# EAGLE design vizszintkapcs_v1_4 (EAGLE 7.1.0)

## Sheet 1 of 2
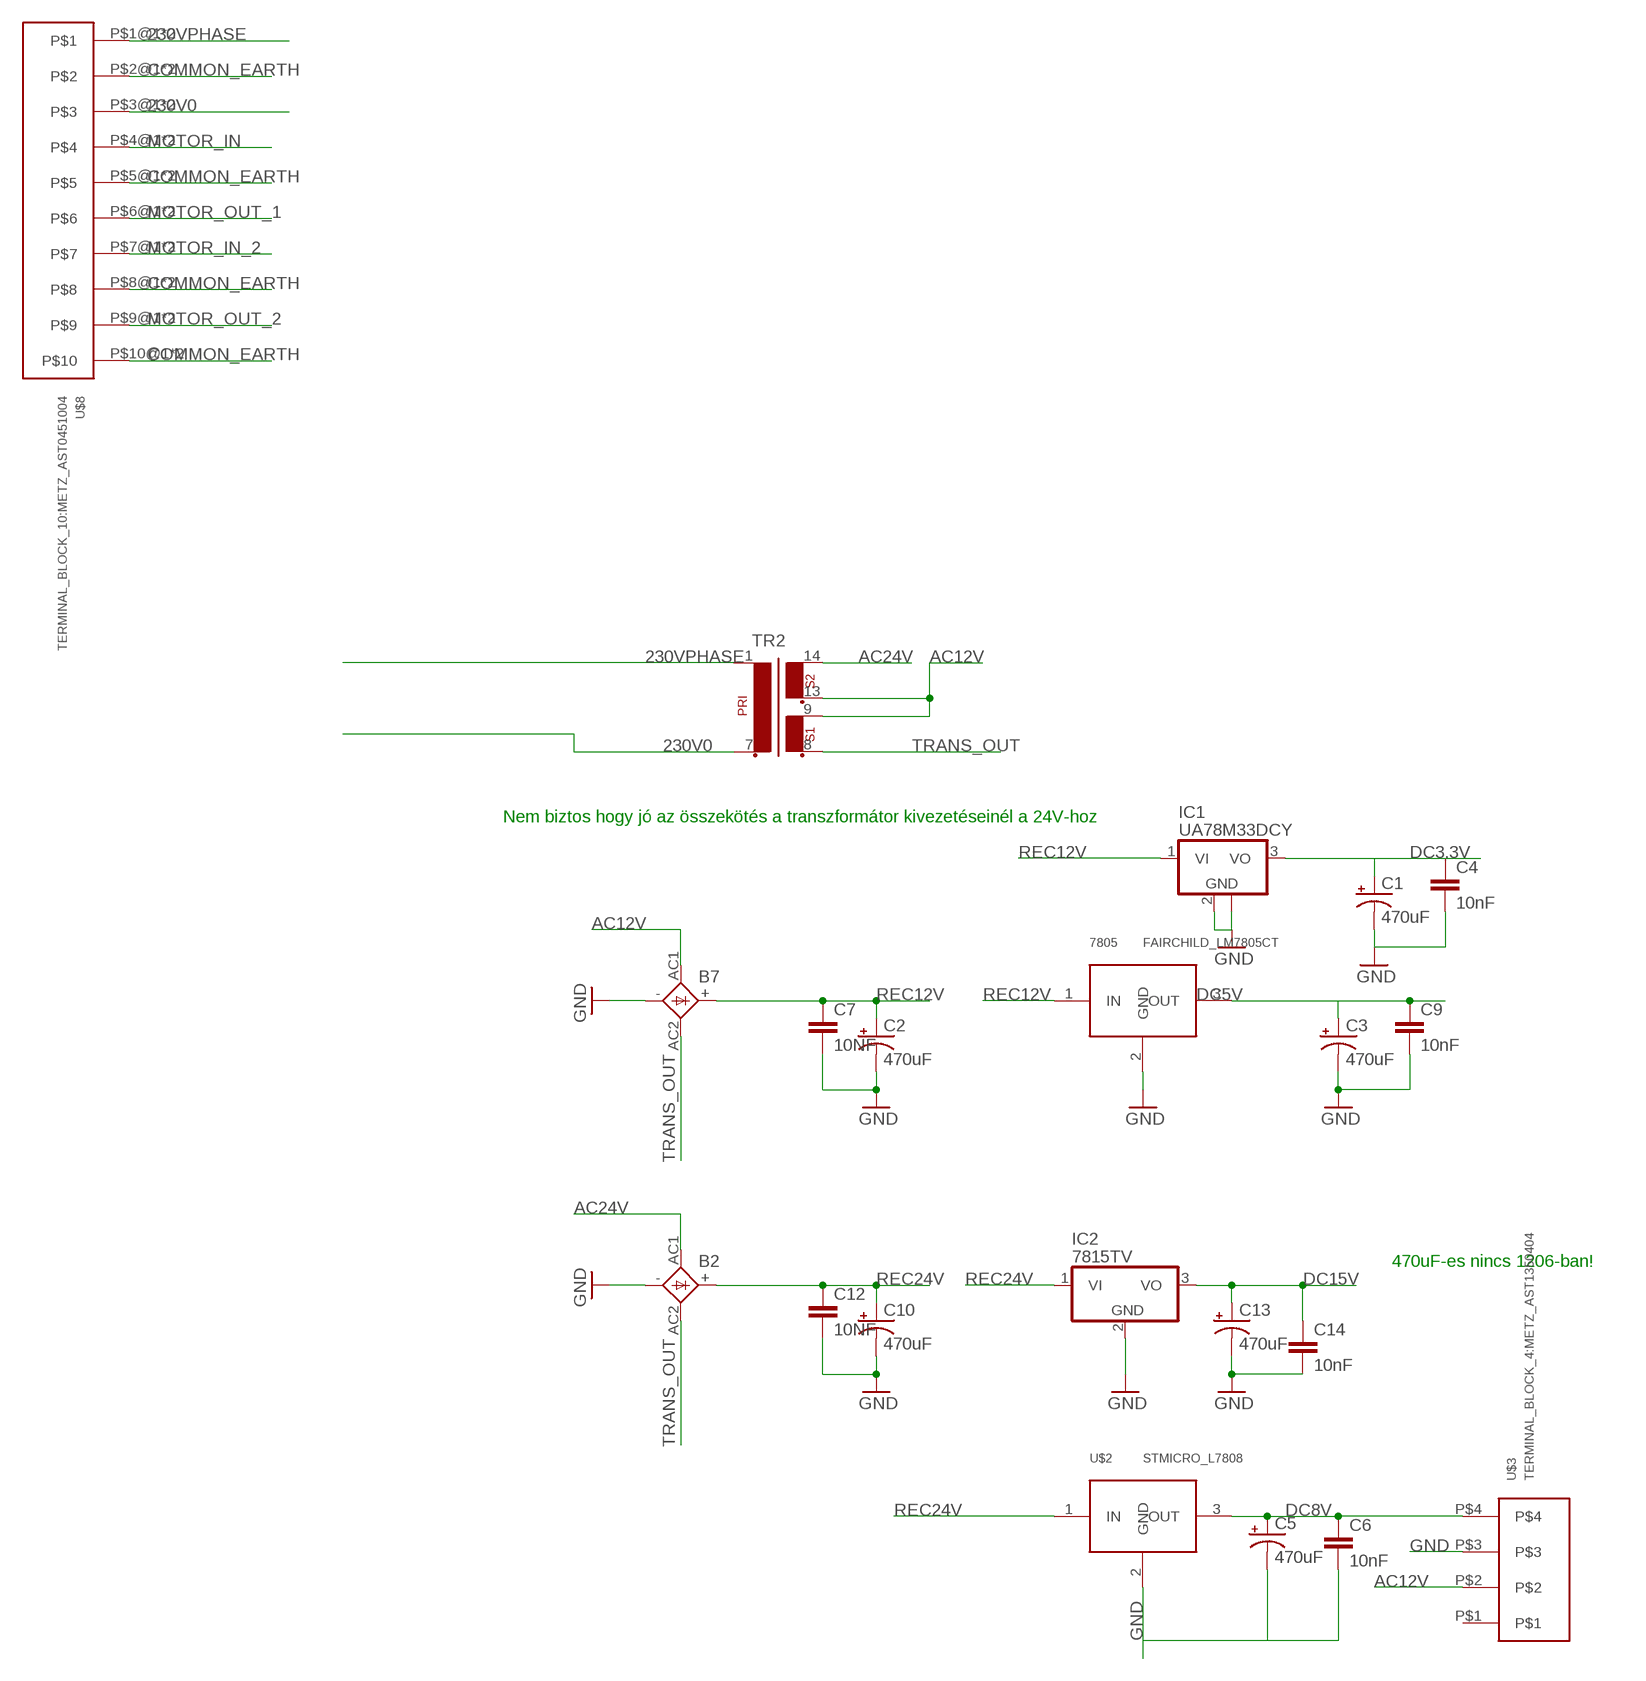
[diagram p0: schematic, sheet 1, part 1 of 2]
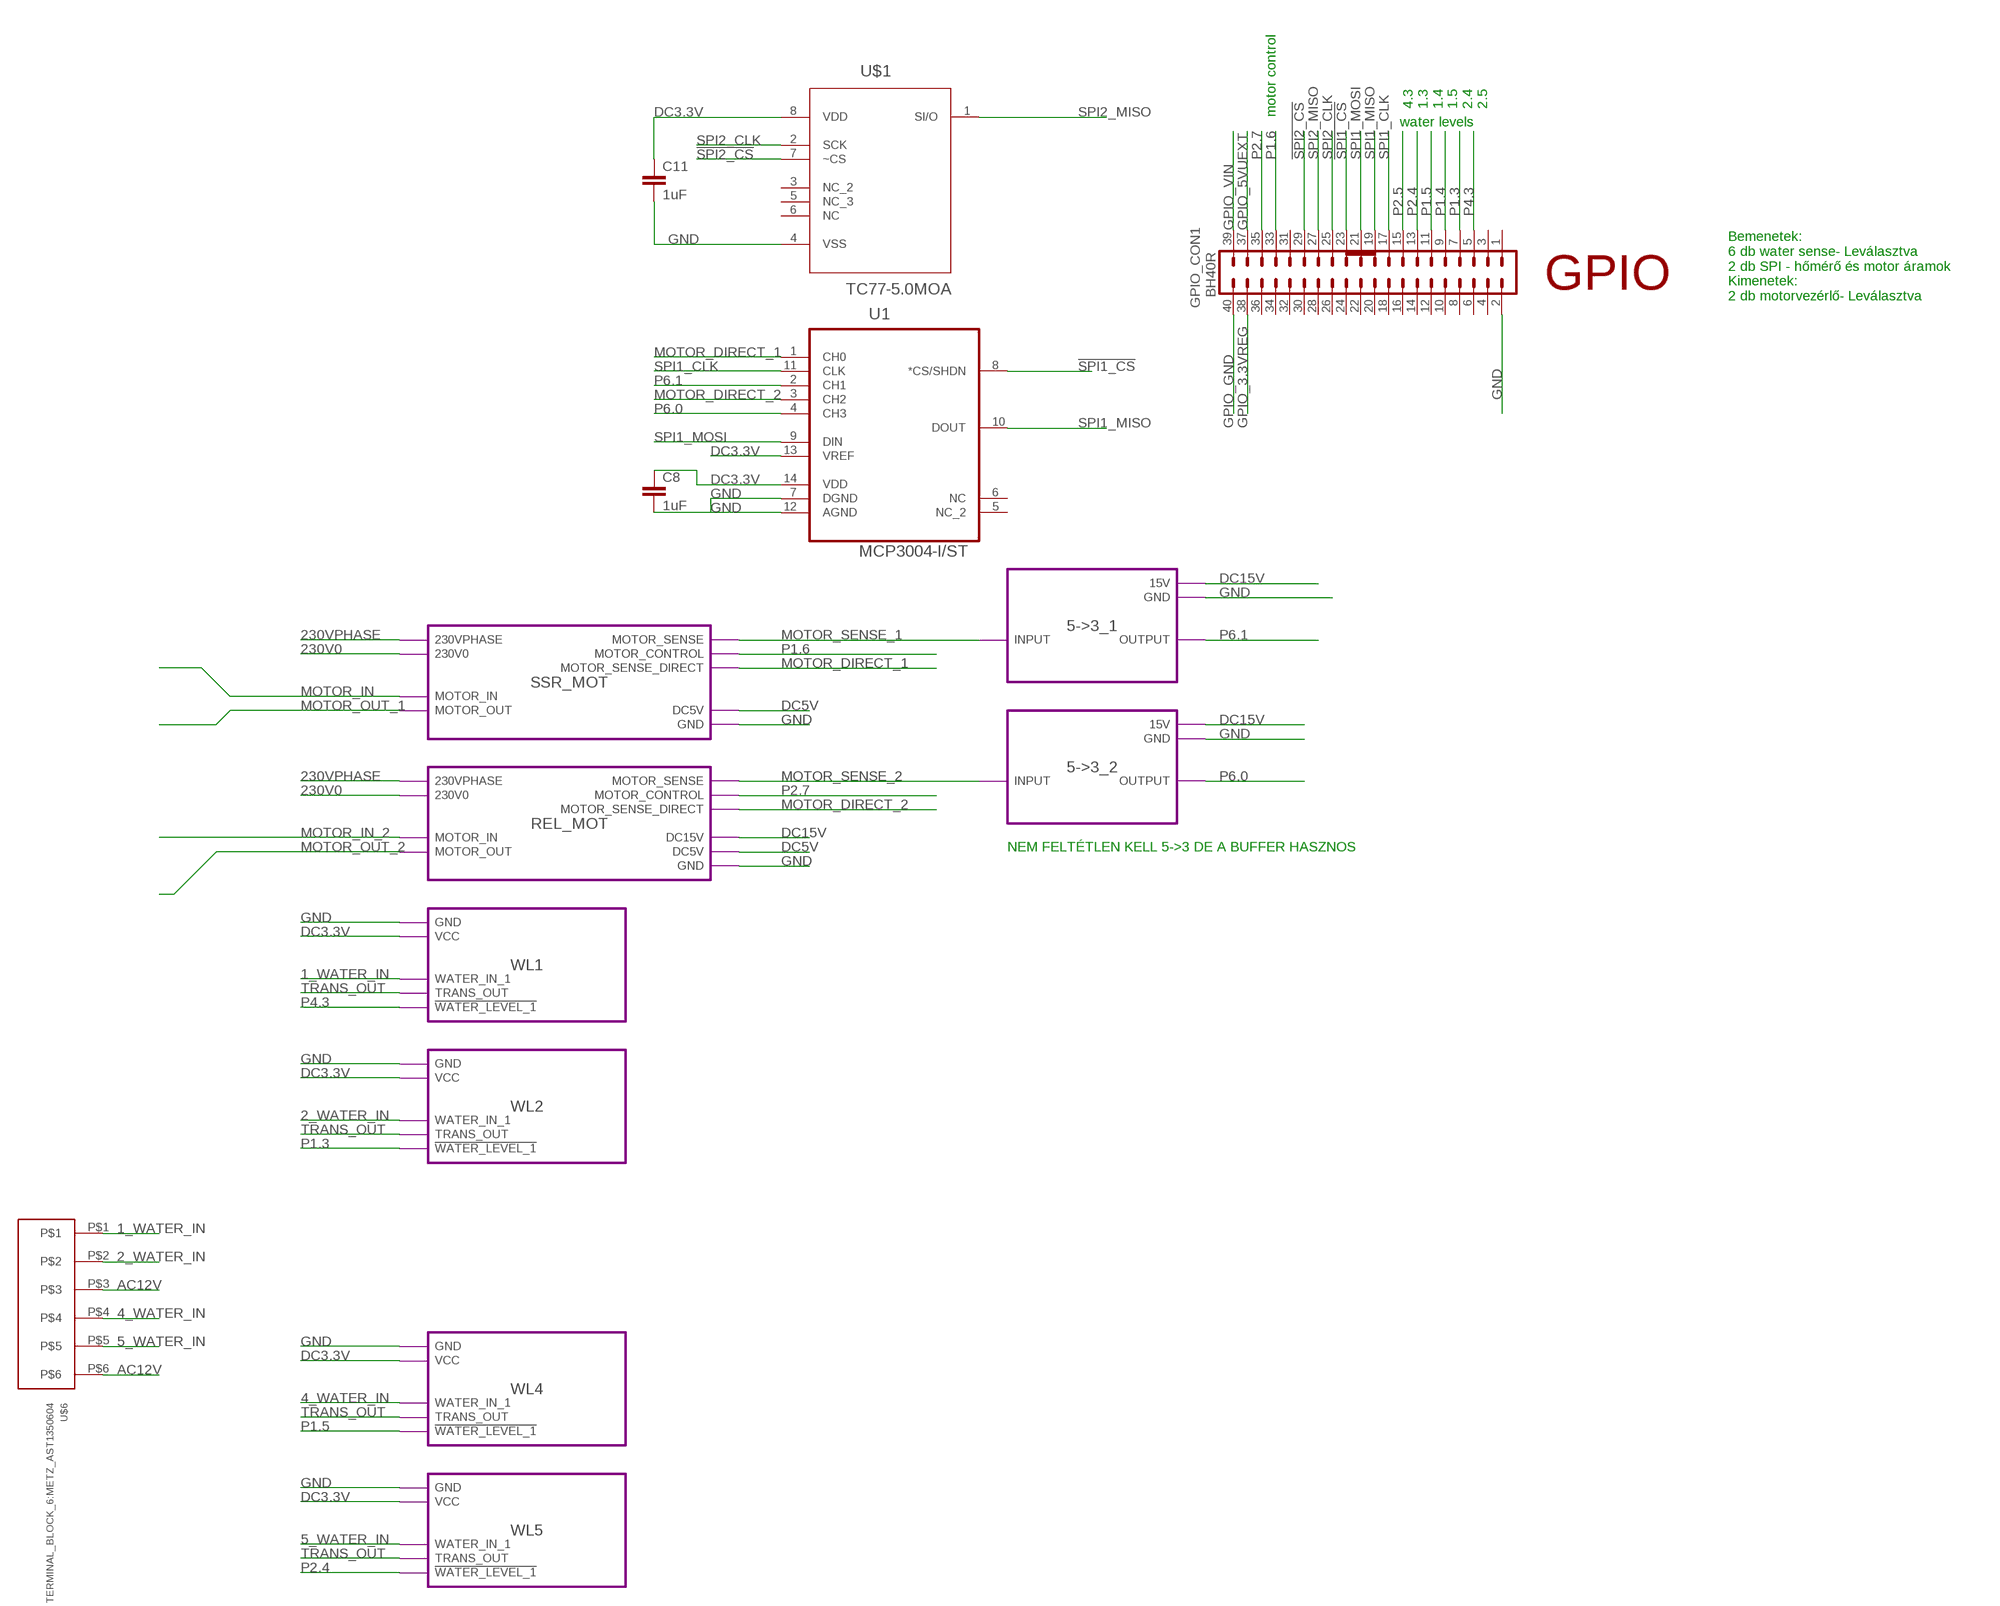
[diagram p1: schematic, sheet 1, part 2 of 2]

### Parts
7805  FAIRCHILD_LM7805CT  [TO220S]
B2  1KAB  [1KAB]
B7  1KAB  [1KAB]
C1  470uF  CPOL-USE3.5-8  [E3,5-8]
C2  470uF  CPOL-USE3.5-8  [E3,5-8]
C3  470uF  CPOL-USE3.5-8  [E3,5-8]
C4  10nF  CAP1206  [1206]
C5  470uF  CPOL-USE3.5-8  [E3,5-8]
C6  10nF  CAP1206  [1206]
C7  10NF  CAP1206  [1206]
C8  1uF  CAP1206  [1206]
C9  10nF  CAP1206  [1206]
C10  470uF  CPOL-USE3.5-8  [E3,5-8]
C11  1uF  CAP1206  [1206]
C12  10NF  CAP1206  [1206]
C13  470uF  CPOL-USE3.5-8  [E3,5-8]
C14  10nF  CAP1206  [1206]
GPIO_CON1  BH40R  ML40R  [BH40R]
IC1  UA78M33DCY  [SOT223]
IC2  7815TV  [TO220V]
TR2  EI54-2  [EI54-2]
U1  MCP3004-I/ST  [SOP65P640X120-14N]
U$1  TC77-5.0MOA  [SOIC127P600X175-8N]
U$2  STMICRO_L7808  [TO220S]
U$3  TERMINAL_BLOCK_4:METZ_AST1350404  [TERMINAL_BLOCK_4:METZ_AST1350404]
U$6  TERMINAL_BLOCK_6:METZ_AST1350604  [TERMINAL_BLOCK_6:METZ_AST1350604]
U$8  TERMINAL_BLOCK_10:METZ_AST0451004  [TERMINAL_BLOCK_10:METZ_AST0451004]

### Module instances
SSR_MOT = SSR_MOTOR_CONTROL
WL1 = WATER_LEVEL_SENSOR
REL_MOT = RELAY_MOTOR_CONTROL
WL4 = WATER_LEVEL_SENSOR
WL5 = WATER_LEVEL_SENSOR
WL2 = WATER_LEVEL_SENSOR
5->3_2 = 5-3VANALOG_TRANSLATE
5->3_1 = 5-3VANALOG_TRANSLATE

### Nets
1_WATER_IN: U$6.P$1 ; port WL1.WATER_IN_1
2_WATER_IN: U$6.P$2 ; port WL2.WATER_IN_1
4_WATER_IN: U$6.P$4 ; port WL4.WATER_IN_1
5_WATER_IN: U$6.P$5 ; port WL5.WATER_IN_1
230V0: TR2.7 U$8.P$3@1 U$8.P$3@2 ; port SSR_MOT.230V0 REL_MOT.230V0
230VPHASE: TR2.1 U$8.P$1@1 U$8.P$1@2 ; port SSR_MOT.230VPHASE REL_MOT.230VPHASE
!SPI1_CS: GPIO_CON1.23 U1.8(*CS/SHDN)
!SPI2_CS: GPIO_CON1.29 U$1.7(~CS)
AC12V: B7.AC1 TR2.9 TR2.13 U$3.P$2 U$6.P$3 U$6.P$6
AC24V: B2.AC1 TR2.14
COMMON_EARTH: U$8.P$2@1 U$8.P$2@2 U$8.P$5@1 U$8.P$5@2 U$8.P$8@1 U$8.P$8@2 U$8.P$10@1 U$8.P$10@2
DC3.3V: C1.+ C4.1 C8.1 C11.1 IC1.3(VO) U1.13(VREF) U1.14(VDD) U$1.8(VDD) ; port WL1.VCC WL2.VCC WL4.VCC WL5.VCC
DC5V: 7805.3(OUT) C3.+ C9.1 ; port SSR_MOT.DC5V REL_MOT.DC5V
DC8V: C5.+ C6.1 U$2.3(OUT) U$3.P$4
DC15V: C13.+ C14.1 IC2.3(VO) ; port REL_MOT.DC15V 5->3_1.15V 5->3_2.15V
GND: 7805.2(GND) B2.- B7.- C1.- C2.- C3.- C4.2 C5.- C6.2 C7.2 C8.2 C9.2 C10.- C11.2 C12.2 C13.- C14.2 GPIO_CON1.2 IC1.2(GND) IC1.4(GND) IC2.2(GND) U1.7(DGND) U1.12(AGND) U$1.4(VSS) U$2.2(GND) U$3.P$3 ; port REL_MOT.GND SSR_MOT.GND WL1.GND WL4.GND WL5.GND WL2.GND 5->3_1.GND 5->3_2.GND
GPIO_3.3VREG: GPIO_CON1.38
GPIO_5VUEXT: GPIO_CON1.37
GPIO_GND: GPIO_CON1.40
GPIO_VIN: GPIO_CON1.39
MOTOR_DIRECT_1: U1.1(CH0) ; port SSR_MOT.MOTOR_SENSE_DIRECT
MOTOR_DIRECT_2: U1.3(CH2) ; port REL_MOT.MOTOR_SENSE_DIRECT
MOTOR_IN: U$8.P$4@1 U$8.P$4@2 ; port SSR_MOT.MOTOR_IN
MOTOR_IN_2: U$8.P$7@1 U$8.P$7@2 ; port REL_MOT.MOTOR_IN
MOTOR_OUT_1: U$8.P$6@1 U$8.P$6@2 ; port SSR_MOT.MOTOR_OUT
MOTOR_OUT_2: U$8.P$9@1 U$8.P$9@2 ; port REL_MOT.MOTOR_OUT
MOTOR_SENSE_1: port SSR_MOT.MOTOR_SENSE 5->3_1.INPUT
MOTOR_SENSE_2: port REL_MOT.MOTOR_SENSE 5->3_2.INPUT
P1.3: GPIO_CON1.7 ; port WL2.!WATER_LEVEL_1
P1.4: GPIO_CON1.9
P1.5: GPIO_CON1.11 ; port WL4.!WATER_LEVEL_1
P1.6: GPIO_CON1.33 ; port SSR_MOT.MOTOR_CONTROL
P2.4: GPIO_CON1.13 ; port WL5.!WATER_LEVEL_1
P2.5: GPIO_CON1.15
P2.7: GPIO_CON1.35 ; port REL_MOT.MOTOR_CONTROL
P4.3: GPIO_CON1.5 ; port WL1.!WATER_LEVEL_1
P6.0: U1.4(CH3) ; port 5->3_2.OUTPUT
P6.1: U1.2(CH1) ; port 5->3_1.OUTPUT
REC12V: 7805.1(IN) B7.+ C2.+ C7.1 IC1.1(VI)
REC24V: B2.+ C10.+ C12.1 IC2.1(VI) U$2.1(IN)
SPI1_CLK: GPIO_CON1.17 U1.11(CLK)
SPI1_MISO: GPIO_CON1.19 U1.10(DOUT)
SPI1_MOSI: GPIO_CON1.21 U1.9(DIN)
SPI2_CLK: GPIO_CON1.25 U$1.2(SCK)
SPI2_MISO: GPIO_CON1.27 U$1.1(SI/O)
TRANS_OUT: B2.AC2 B7.AC2 TR2.8 ; port WL1.TRANS_OUT WL2.TRANS_OUT WL4.TRANS_OUT WL5.TRANS_OUT
Unconnected: GPIO_CON1.1 GPIO_CON1.3 GPIO_CON1.4 GPIO_CON1.6 GPIO_CON1.8 GPIO_CON1.10 GPIO_CON1.12 GPIO_CON1.14 GPIO_CON1.16 GPIO_CON1.18 GPIO_CON1.20 GPIO_CON1.22 GPIO_CON1.24 GPIO_CON1.26 GPIO_CON1.28 GPIO_CON1.30 GPIO_CON1.31 GPIO_CON1.32 GPIO_CON1.34 GPIO_CON1.36 U1.5(NC_2) U1.6(NC) U$1.3(NC_2) U$1.5(NC_3) U$1.6(NC) U$3.P$1

### Notes on the sheet
- 4.3
  1.3
  1.4
  1.5
  2.4
  2.5
- motor control | water levels
- GPIO
- Bemenetek: 
  6 db water sense- Leválasztva
  2 db SPI - hőmérő és motor áramok
  Kimenetek:
  2 db motorvezérlő- Leválasztva
- NEM FELTÉTLEN KELL 5->3 DE A BUFFER HASZNOS
- Nem biztos hogy jó az összekötés a transzformátor kivezetéseinél a 24V-hoz
- 470uF-es nincs 1206-ban!

## Sheet 2 of 2

## Library data of the parts
7805 = forCNC:FAIRCHILD_LM7805CT
B2 B7 = rectifier:1KAB: RECTIFIER grid 5,08 x 5,08 mm
C1-C3 C5 C10 C13 = adafruit:CPOL-US: POLARIZED CAPACITOR, American symbol
C4 C6-C9 C11 C12 C14 = SparkFun-Capacitors:CAP: Capacitor Standard 0603 ceramic capacitor, and 0.1" leaded capacitor.
GPIO_CON1 = con-harting-ml:ML40: HARTING
IC1 = linear:UA78M*: POSITIVE-VOLTAGE REGULATORS Source: http://focus.ti.com/lit/ds/symlink/ua78m33.pdf
IC2 = linear:78*: Positive VOLTAGE REGULATOR Source: http://cache.national.com/ds/LM/LM78L05.pdf http://www.fairchildsemi.com/ds/LM/LM7805.pdf
TR2 = trafo:EI54-2: TRANSFORMER 1 primary winding, 2 secondary windings ERA
U1 = Microchip_By_element14_Batch_1:MCP3004-I/ST: IC, 10BIT ADC 4-CH, SMD; MPN: MCP3004-I/ST; OC_FARNELL: 1523365; OC_NEWARK: 74M3032; PACKAGE: 14TSSOP; SUPPLIER: Microchip
U$1 = Microchip_By_element14_Batch_1:TC77-5.0MOA: Thermal Sensor; DESCRIPTION: Thermal Sensor; MPN: TC77-5.0MOA; OC_FARNELL: 1439514; OC_NEWARK: 65K1077; PACKAGE: SOIC-8; SUPPLIER: Microchip
U$2 = forCNC:STMICRO_L7808
U$3 = forCNC:TERMINAL_BLOCK_4:METZ_AST1350404
U$6 = forCNC:TERMINAL_BLOCK_6:METZ_AST1350604
U$8 = forCNC:TERMINAL_BLOCK_10:METZ_AST0451004

## Module SSR_MOTOR_CONTROL
Ports: MOTOR_CONTROL(in) MOTOR_SENSE(out) MOTOR_OUT(out) 230V0(pwr) DC5V(io) GND(io) MOTOR_IN(io) 230VPHASE(io) MOTOR_SENSE_DIRECT(out)
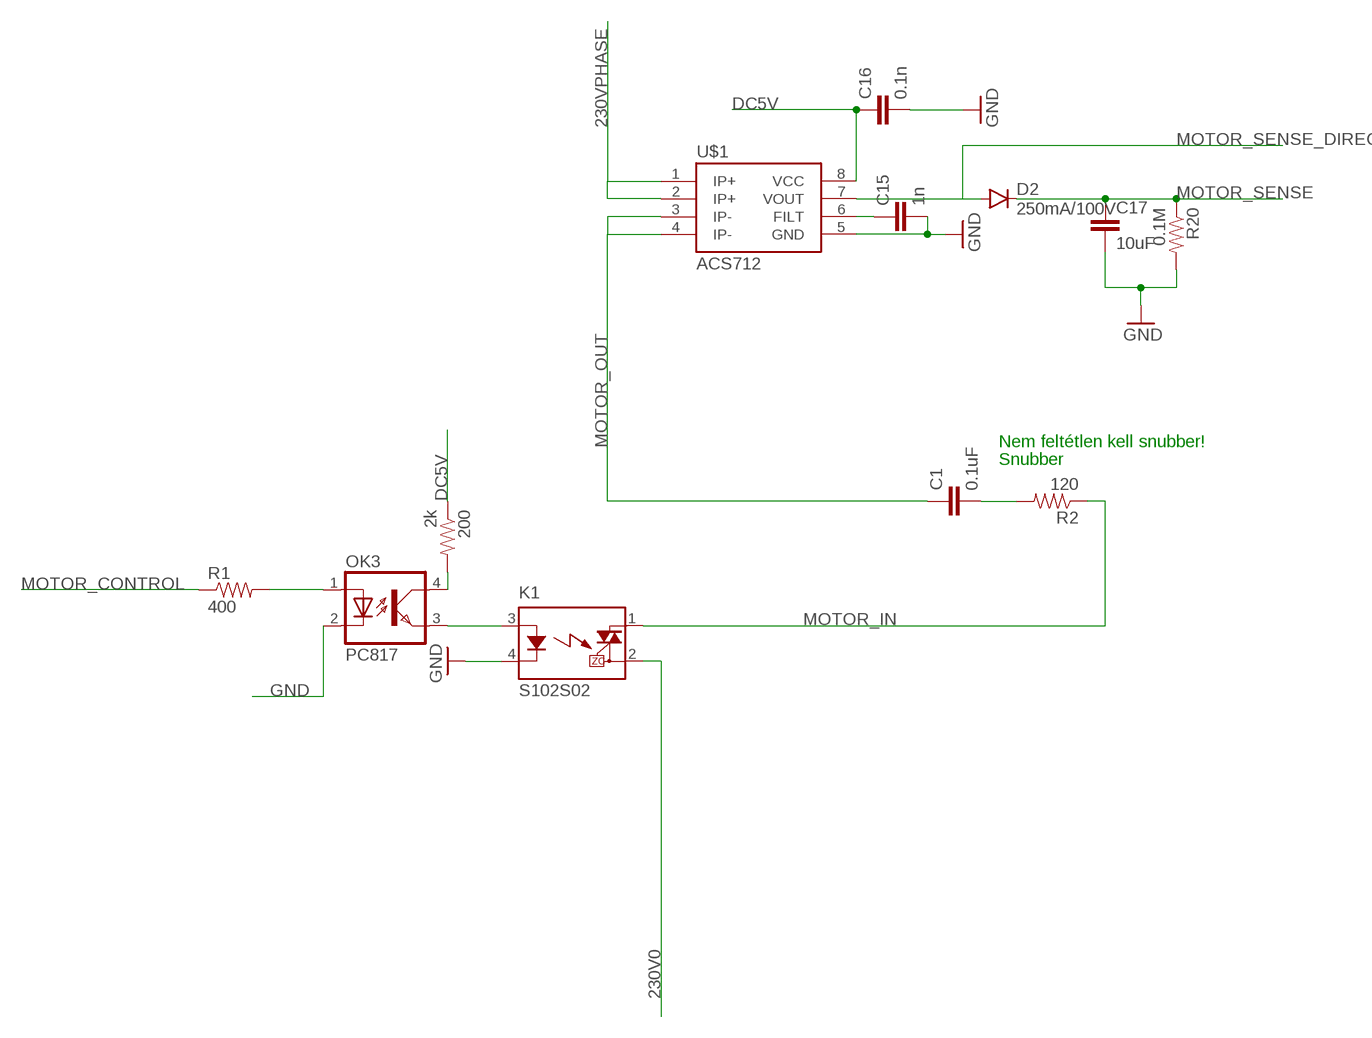
[diagram p2: schematic, module SSR_MOTOR_CONTROL, sheet 1]

### Parts
200  2k  RESISTOR1206  [1206]
C1  0.1uF  CAPPTH3  [CAP-PTH-LARGE]
C15  1n  CAP1206  [1206]
C16  0.1n  CAP1206  [1206]
C17  10uF  CAP1206  [1206]
D2  250mA/100V  DIODEBAS16  [SOD-323]
K1  S102S02  [S202S02]
OK3  PC817  [DIL04]
R1  400  RESISTOR1206  [1206]
R2  120  RESISTORKIT  [AXIAL-0.3-KIT]
R20  0.1M  RESISTOR1206  [1206]
U$1  ACS712  [SO08]

### Nets
230V0: K1.2(DS2)
230VPHASE: U$1.1(IP+) U$1.2(IP+)
DC5V: 200.1 C16.1 U$1.8(VCC)
GND: C15.2 C16.2 C17.2 K1.4(K) OK3.2(C) R20.2 U$1.5(GND)
MOTOR_CONTROL: R1.1
MOTOR_IN: K1.1(DS1) R2.P$1
MOTOR_OUT: C1.1 U$1.3(IP-) U$1.4(IP-)
MOTOR_SENSE: C17.1 D2.C R20.1
MOTOR_SENSE_DIRECT: D2.A U$1.7(VOUT)
N$1: C1.2 R2.P$2
N$3: 200.2 OK3.4(COL)
N$4: K1.3(A) OK3.3(EMIT)
N$13: OK3.1(A) R1.2
N$26: C15.1 U$1.6(FILT)

### Notes on the sheet
- Nem feltétlen kell snubber!
- Snubber

### Library data of the parts
200 R1 R2 R20 = SparkFun-Resistors:RESISTOR: Resistor Basic schematic elements and footprints for 0603, 1206, and PTH resistors.
C1 = SparkFun-Passives:CAP: Capacitor Standard 0603 ceramic capacitor, and 0.1" leaded capacitor.
C15-C17 = SparkFun-Capacitors:CAP: Capacitor Standard 0603 ceramic capacitor, and 0.1" leaded capacitor.
D2 = SparkFun-DiscreteSemi:DIODE: Diode These are standard reverse protection diodes and small signal diodes. SMA package can handle up to about 1A. SOD-323 can handle about 200mA. What the SOD-323 package when ordering, there are some mfgs out there that are 5-pin packages.; PROD_ID: DIO-09646
K1 = relay:S*02S02: IT(rms) 8A, Zero Cross type SIP 4pin Triac output SSR Source: http://sharp-world.com/products/device/lineup/data/pdf/datasheet/s102s02_e.pdf
OK3 = optocoupler:PC817: SHARP OPTO COUPLER; MPN: PC817X4J000F; OC_FARNELL: 9707727; OC_NEWARK: 97K7059
U$1 = SparkFun-AnalogIC:ACS712: Hall-effect-based isolated linear current sensor

## Module WATER_LEVEL_SENSOR
Ports: WATER_IN_1(in) !WATER_LEVEL_1(out) TRANS_OUT(pwr) GND(io) VCC(io)
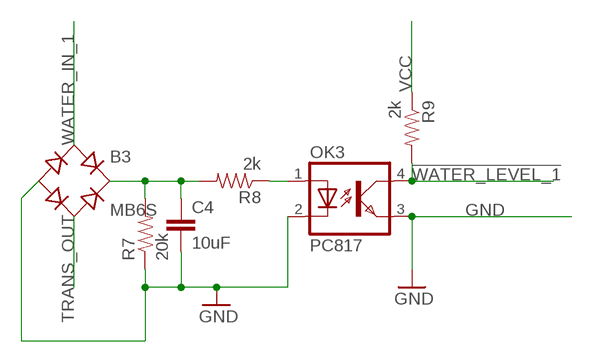
[diagram p3: schematic, module WATER_LEVEL_SENSOR, sheet 1]

### Parts
B3  MB6S  [SOIC-4]
C4  10uF  CAP1206  [1206]
OK3  PC817  [DIL04]
R7  20k  RESISTOR1206  [1206]
R8  2k  RESISTOR1206  [1206]
R9  2k  RESISTOR1206  [1206]

### Nets
!WATER_LEVEL_1: OK3.4(COL) R9.2
GND: B3.- C4.2 OK3.2(C) OK3.3(EMIT) R7.1
N$12: B3.+ C4.1 R7.2 R8.2
N$13: OK3.1(A) R8.1
TRANS_OUT: B3.~2(AC2)
VCC: R9.1
WATER_IN_1: B3.~1(AC1)

### Library data of the parts
B3 = rectifier:MB*S: Bridge Rectifier Source: http://www.fairchildsemi.com/ds/MB/MB6S.pdf
C4 = SparkFun-Passives:CAP: Capacitor Standard 0603 ceramic capacitor, and 0.1" leaded capacitor.
OK3 = optocoupler:PC817: SHARP OPTO COUPLER; MPN: PC817X4J000F; OC_FARNELL: 9707727; OC_NEWARK: 97K7059
R7-R9 = SparkFun-Resistors:RESISTOR: Resistor Basic schematic elements and footprints for 0603, 1206, and PTH resistors.

## Module RELAY_MOTOR_CONTROL
Ports: MOTOR_CONTROL(in) MOTOR_SENSE(out) MOTOR_OUT(out) 230V0(pwr) DC5V(io) DC15V(io) GND(io) MOTOR_IN(io) 230VPHASE(io) MOTOR_SENSE_DIRECT(out)
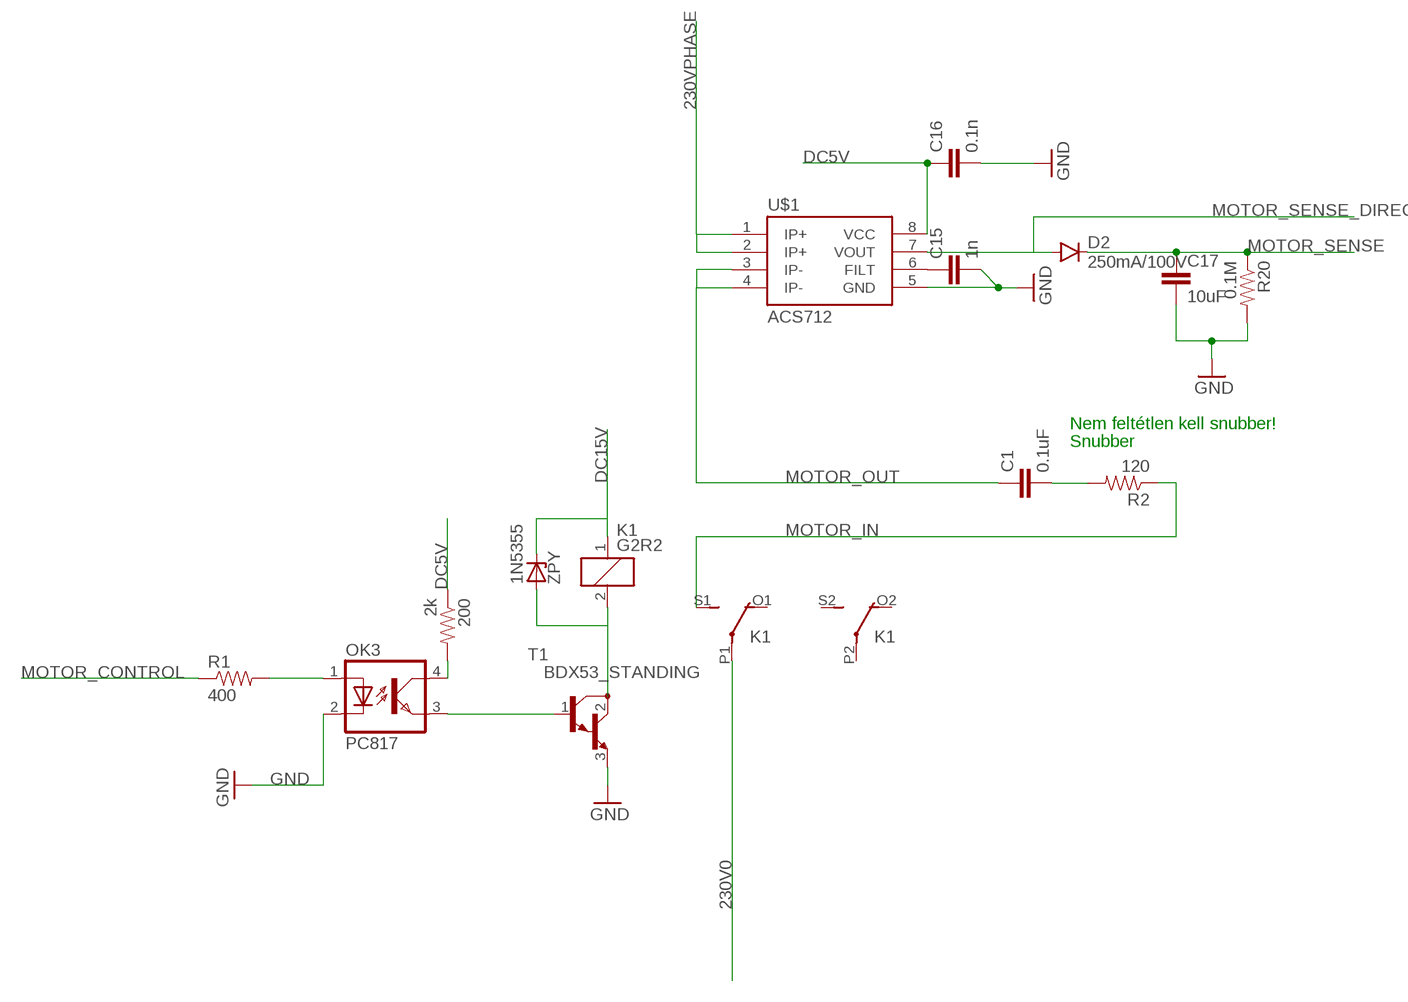
[diagram p4: schematic, module RELAY_MOTOR_CONTROL, sheet 1]

### Parts
1N5355  ZPY  [DO41Z10]
200  2k  RESISTOR1206  [1206]
C1  0.1uF  CAPPTH3  [CAP-PTH-LARGE]
C15  1n  CAP1206  [1206]
C16  0.1n  CAP1206  [1206]
C17  10uF  CAP1206  [1206]
D2  250mA/100V  DIODEBAS16  [SOD-323]
K1  G2R2  [G2R2]
OK3  PC817  [DIL04]
R1  400  RESISTOR1206  [1206]
R2  120  RESISTORKIT  [AXIAL-0.3-KIT]
R20  0.1M  RESISTOR1206  [1206]
T1  BDX53_STANDING  [TO220S]
U$1  ACS712  [SO08]

### Nets
230V0: K1.P1(2:P)
230VPHASE: U$1.1(IP+) U$1.2(IP+)
DC5V: 200.1 C16.1 U$1.8(VCC)
DC15V: 1N5355.C K1.1
GND: C15.2 C16.2 C17.2 OK3.2(C) R20.2 T1.3(E) U$1.5(GND)
MOTOR_CONTROL: R1.1
MOTOR_IN: K1.S1(2:S) R2.P$1
MOTOR_OUT: C1.1 U$1.3(IP-) U$1.4(IP-)
MOTOR_SENSE: C17.1 D2.C R20.1
MOTOR_SENSE_DIRECT: D2.A U$1.7(VOUT)
N$1: C1.2 R2.P$2
N$3: 200.2 OK3.4(COL)
N$4: OK3.3(EMIT) T1.1(B)
N$10: 1N5355.A K1.2 T1.2(C)
N$13: OK3.1(A) R1.2
N$26: C15.1 U$1.6(FILT)
Unconnected: K1.O1(2:O) K1.O2(3:O) K1.P2(3:P) K1.S2(3:S)

### Notes on the sheet
- Nem feltétlen kell snubber!
- Snubber

### Library data of the parts
1N5355 = diode:ZPY: Z DIODE 1 W
200 R1 R2 R20 = SparkFun-Resistors:RESISTOR: Resistor Basic schematic elements and footprints for 0603, 1206, and PTH resistors.
C1 C15-C17 = SparkFun-Passives:CAP: Capacitor Standard 0603 ceramic capacitor, and 0.1" leaded capacitor.
D2 = SparkFun-DiscreteSemi:DIODE: Diode These are standard reverse protection diodes and small signal diodes. SMA package can handle up to about 1A. SOD-323 can handle about 200mA. What the SOD-323 package when ordering, there are some mfgs out there that are 5-pin packages.; PROD_ID: DIO-09646
K1 = relay:G2R2: RELAY 2 x switch, Omron; MF: OMRON COMPONENTS USA; MPN: G2R-2-DC6; OC_FARNELL: unknown; OC_NEWARK: 89C5317
OK3 = optocoupler:PC817: SHARP OPTO COUPLER; MPN: PC817X4J000F; OC_FARNELL: 9707727; OC_NEWARK: 97K7059
T1 = forCNC:BDX53_STANDING
U$1 = SparkFun-AnalogIC:ACS712: Hall-effect-based isolated linear current sensor

## Module USB-SERIAL
Ports: TXD(out) RXD(in) !RTS(out) !DTR(out) D+(io) D-(io) !CTS(out) GND(pwr) VCC(pwr)
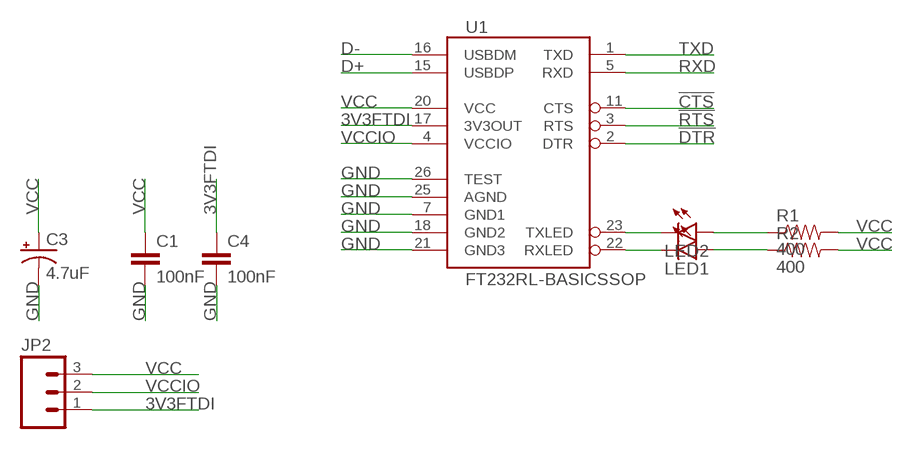
[diagram p5: schematic, module USB-SERIAL, sheet 1]

### Parts
C1  100nF  CAP1206  [1206]
C3  4.7uF  CAP_POL1206  [EIA3216]
C4  100nF  CAP1206  [1206]
JP2  M03PTH  [1X03]
LED1  LED-FKIT-1206  [FKIT-LED-1206]
LED2  LED-FKIT-1206  [FKIT-LED-1206]
R1  400  RESISTOR1206  [1206]
R2  400  RESISTOR1206  [1206]
U1  FT232RL-BASICSSOP  [SSOP28DB]

### Nets
3V3FTDI: C4.1 JP2.1 U1.17(3V3OUT)
!CTS: U1.11(CTS)
!DTR: U1.2(DTR)
!RTS: U1.3(RTS)
D+: U1.15(USBDP)
D-: U1.16(USBDM)
GND: C1.2 C3.C(-) C4.2 U1.7(GND1) U1.18(GND2) U1.21(GND3) U1.25(AGND) U1.26(TEST)
N$1: LED1.C U1.22(RXLED)
N$2: LED2.C U1.23(TXLED)
N$3: LED2.A R1.1
N$4: LED1.A R2.1
RXD: U1.5(RXD)
TXD: U1.1(TXD)
VCC: C1.1 C3.A(+) JP2.3 R1.2 R2.2 U1.20(VCC)
VCCIO: JP2.2 U1.4(VCCIO)

### Library data of the parts
C1 C4 = SparkFun-Passives:CAP: Capacitor Standard 0603 ceramic capacitor, and 0.1" leaded capacitor.
C3 = SparkFun-Passives:CAP_POL: Capacitor Polarized These are standard SMD and PTH capacitors. Normally 10uF, 47uF, and 100uF in electrolytic and tantalum varieties. Always verify the external diameter of the through hole cap, it varies with capacity, voltage, and manufacturer. The EIA devices should be standard.
JP2 = SparkFun-Connectors:M03: Header 3 Standard 3-pin 0.1" header. Use with straight break away headers (SKU : PRT-00116), right angle break away headers (PRT-00553), swiss pins (PRT-00743), machine pins (PRT-00117), and female headers (PRT-00115). Molex polarized connector foot print use with SKU : PRT-08232 with associated crimp pins and housings.
LED1 LED2 = SparkFun-LED:LED: LEDs Standard schematic elements and footprints for 5mm, 3mm, 1206, and 0603 sized LEDs. 5mm - Spark Fun Electronics SKU : COM-00529 (and others)
R1 R2 = SparkFun-Resistors:RESISTOR: Resistor Basic schematic elements and footprints for 0603, 1206, and PTH resistors.
U1 = SparkFun-DigitalIC:FT232RL-BASIC: USB UART This is the simplified version of the FT232RL unit. Only what you need, nothing you don't. Spark Fun Electronics SKU : COM-00650

## Module 5-3VANALOG_TRANSLATE
Ports: 15V(io) GND(io) INPUT(io) OUTPUT(io)
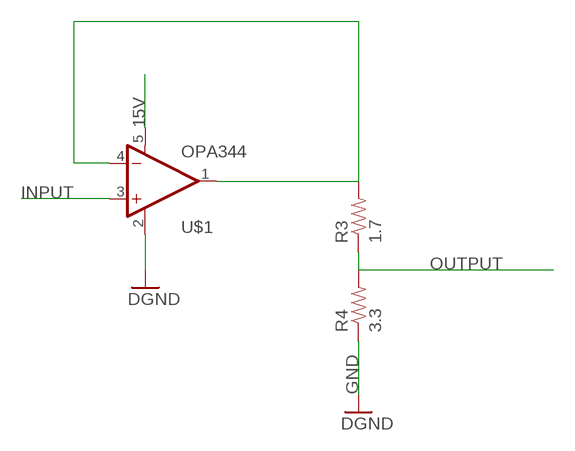
[diagram p6: schematic, module 5-3VANALOG_TRANSLATE, sheet 1]

### Parts
R3  1.7  RESISTOR1206  [1206]
R4  3.3  RESISTOR1206  [1206]
U$1  OPA344  [SOT23-5]

### Nets
15V: U$1.5(V+)
GND: R4.1 U$1.2(V-) ; supply symbol labelled DGND
INPUT: U$1.3(+IN)
N$1: R3.2 U$1.1(OUT) U$1.4(-IN)
OUTPUT: R3.1 R4.2

### Library data of the parts
R3 R4 = SparkFun-Passives:RESISTOR: Resistor Basic schematic elements and footprints for 0603, 1206, and PTH resistors.
U$1 = SparkFun-AnalogIC:OPA344: Single gate rail-to-rail output op-amp. Inputs extend 300mV past rails.

## Net classes
0 Default: width 0.203 mm, drill 0.305 mm, clearance 0.152 mm
1 Ground: width 0.203 mm, drill 0.305 mm, clearance 0.152 mm to class 0, clearance 0.152 mm
2 Power: width 0.203 mm, drill 0.305 mm, clearance 0.152 mm to class 0, clearance 0.152 mm to class 1, clearance 0.152 mm

## Board
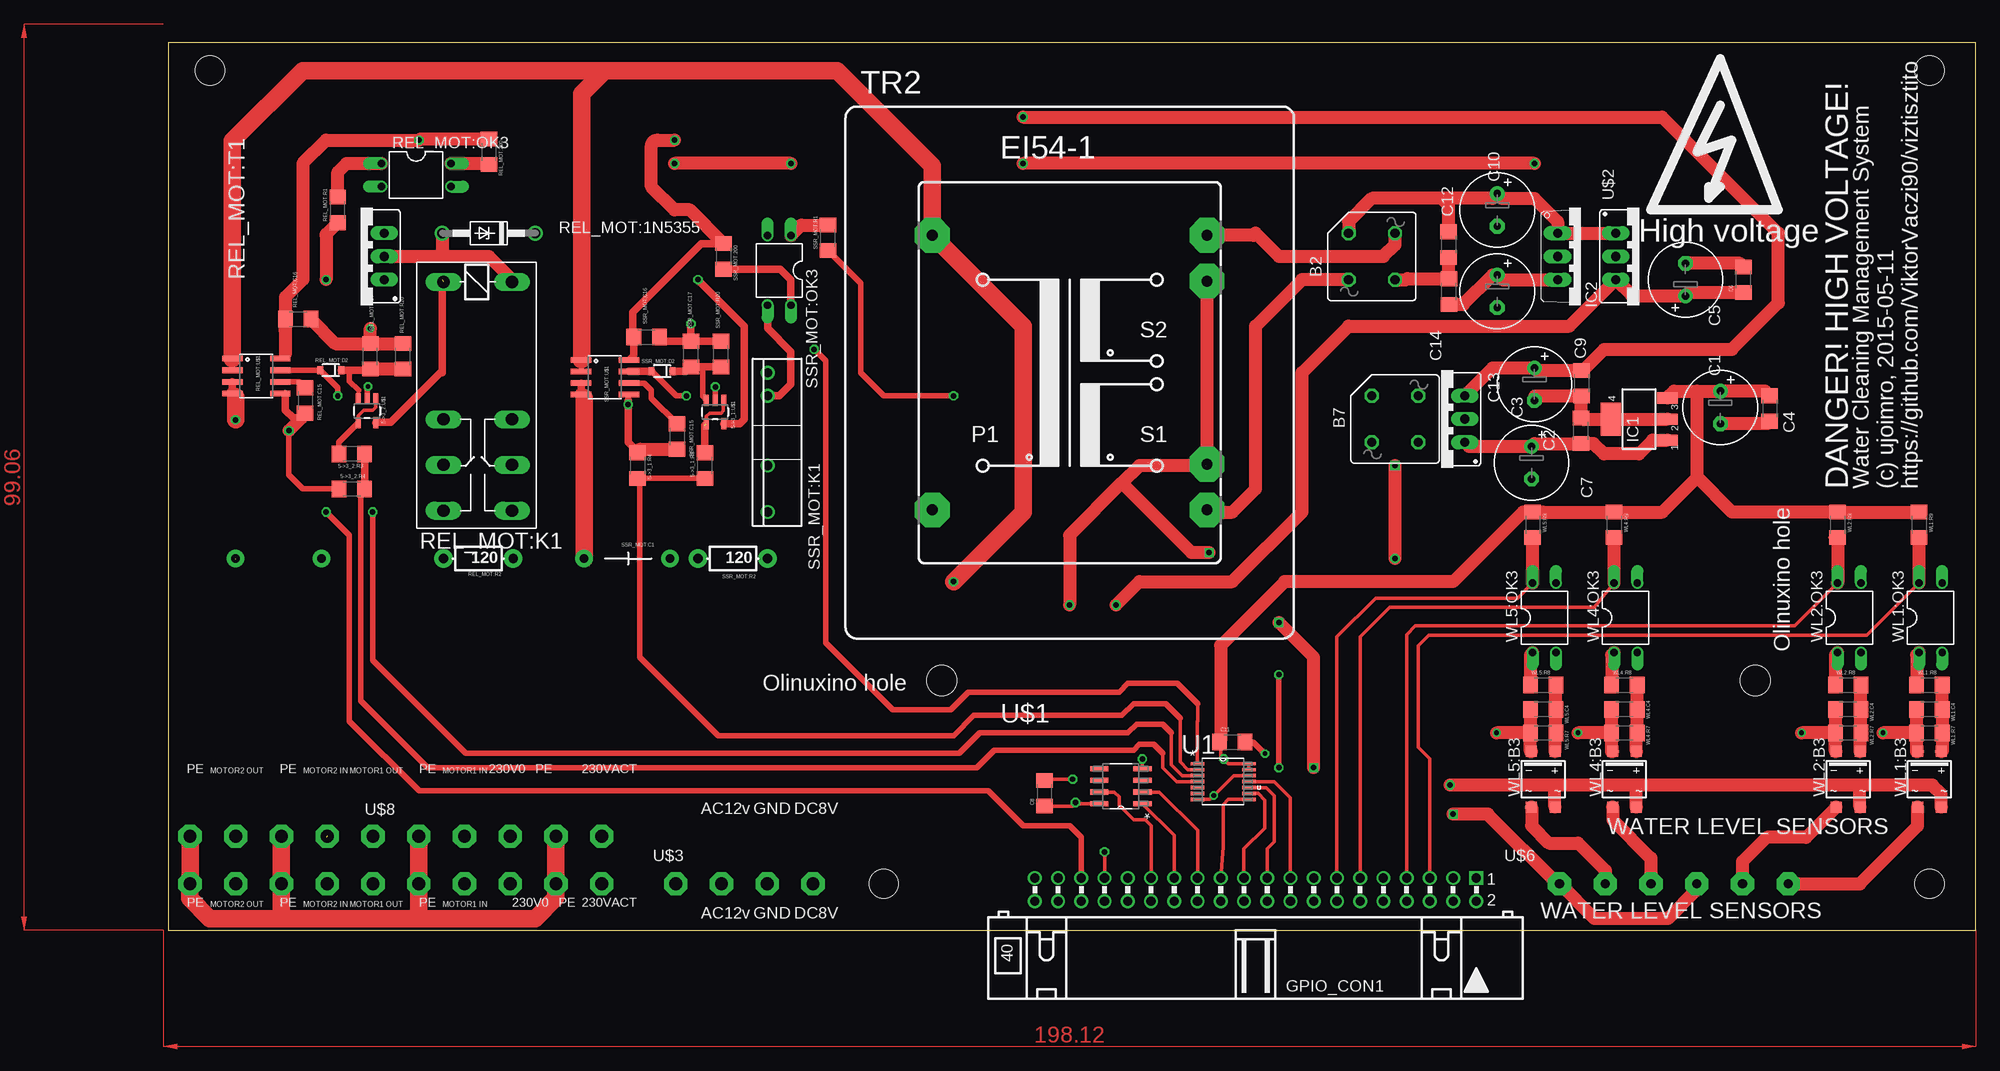
[diagram p7: board, top side]
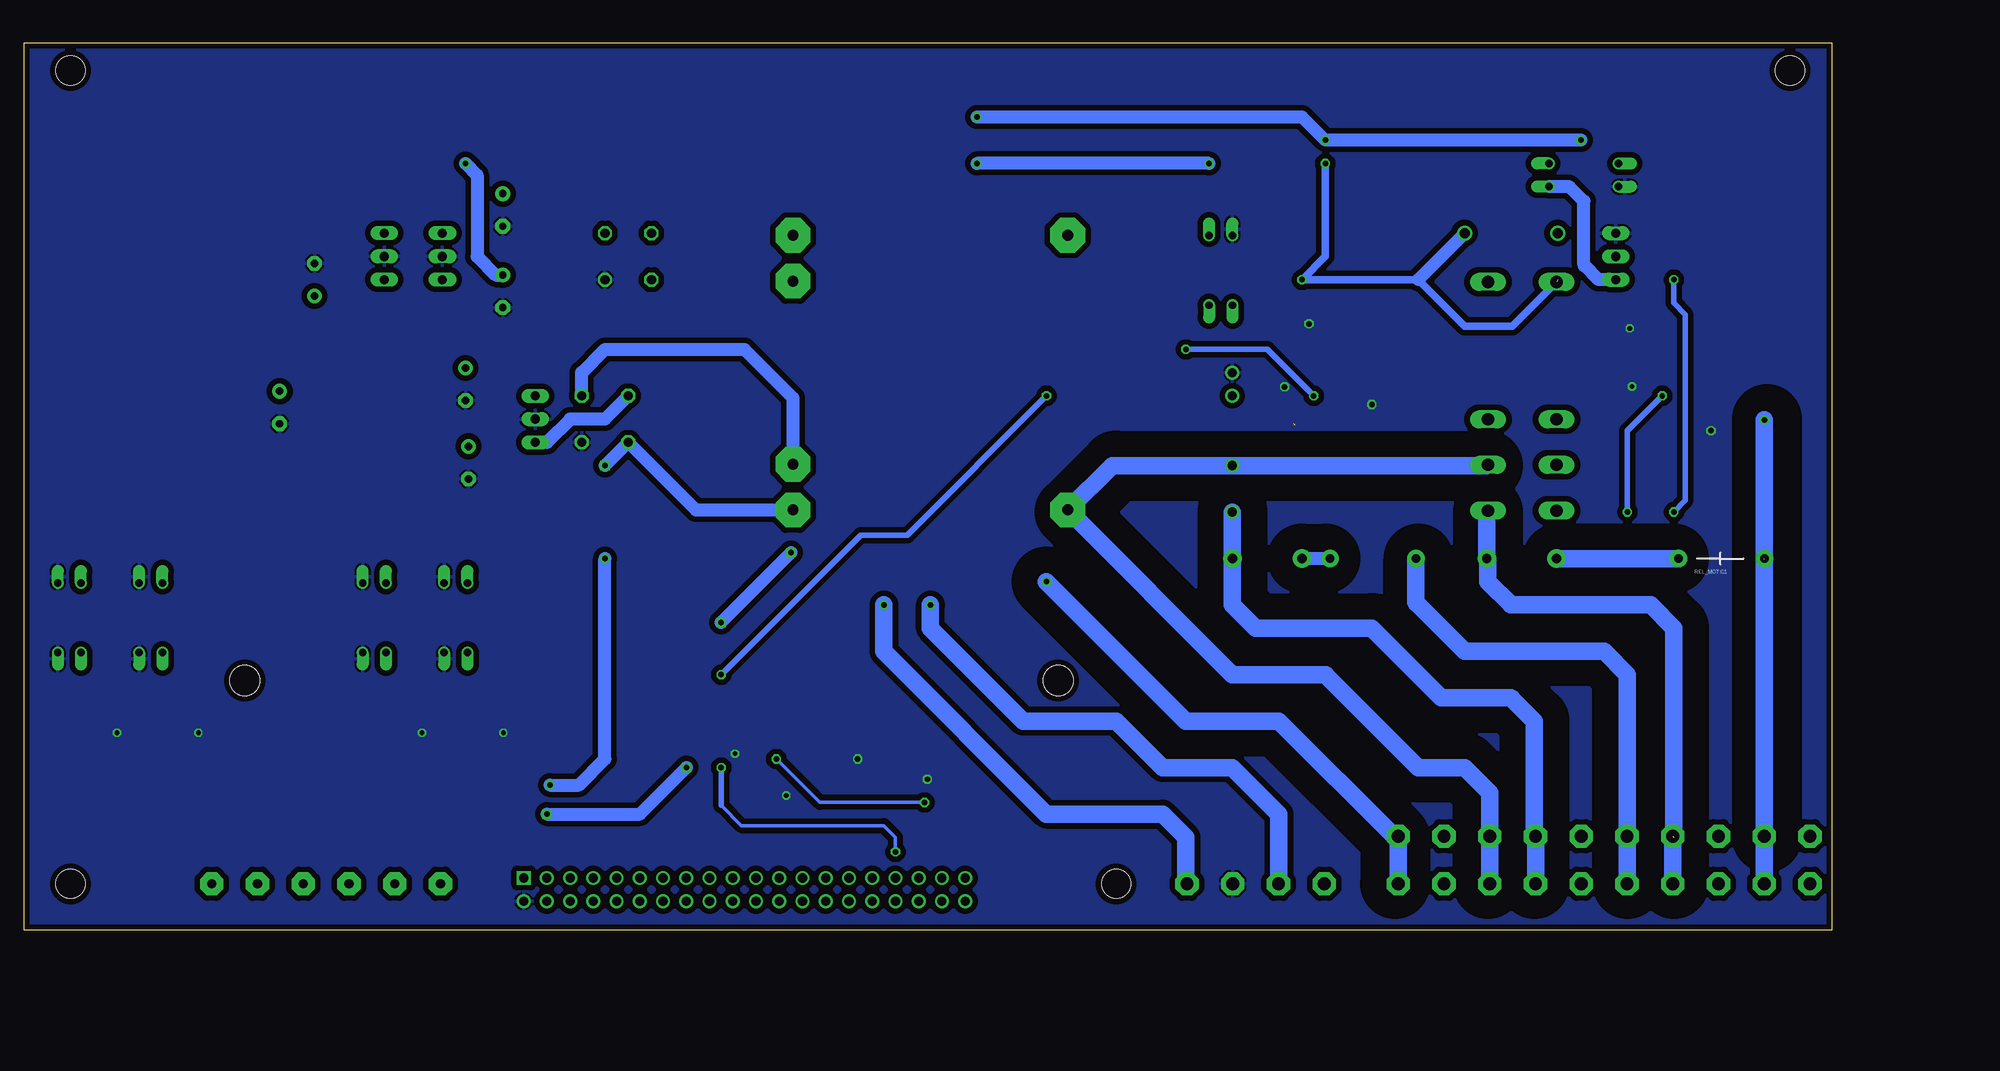
[diagram p8: board, bottom side, seen from below]

Size 197.61 x 97.03 mm. Coordinates in mm from the lower left corner, seen from the top.
Outline: 0,0 197.61,0 197.61,97.03 0,97.03 0,0
Copper layers (1*16): Top 0.035mm / dielectric 1.5mm / Bottom 0.035mm
Design rules "default *": minimum track width 7mil, minimum drill 8mil, track to track 12mil, track to pad 6mil, pad to pad 6mil, via to via 10mil, smd to smd 6mil, copper to edge 6mil, drill to drill 6mil, minimum pad ring 10mil, minimum via ring 8mil, stop-mask expansion 4mil, vias tented up to drill 0mil, thermal gap 10mil
Holes 3.3 mm at 84.58,27.3 173.48,27.3
Holes 3.2 mm at 192.53,5.08 192.53,93.98 4.57,93.98 78.23,5.08
bRestrict: 32 lines

### Footprints (pad centres in the part's own frame; a part is rotated, then mirrored left to right if it is on the bottom)
1206 = smd 1.6 x 1.8: 1 -1.4,0; 2 1.4,0
SOT23-5 = smd 0.55 x 1.2: 1 -0.95,-1.3; 2 0,-1.3; 3 0.95,-1.3; 4 0.95,1.3; 5 -0.95,1.3
TO220S = drill 1.016 long: 1 -2.54,-2.54; 2 0,-2.54; 3 2.54,-2.54
1KAB = drill 1.016 octagon: + 2.54,-2.54; - -2.54,2.54; AC1 -2.54,-2.54; AC2 2.54,2.54
E3,5-8 = drill 0.813 pad 1.6: + -1.778,0 | drill 0.813 pad 1.6 octagon: - 1.778,0
BH40R = drill 1 square: 1 -24.13,-1.27 | drill 1: 2 -24.13,1.27; 3 -21.59,-1.27; 4 -21.59,1.27; 5 -19.05,-1.27; 6 -19.05,1.27; 7 -16.51,-1.27; 8 -16.51,1.27; 9 -13.97,-1.27; 10 -13.97,1.27; 11 -11.43,-1.27; 12 -11.43,1.27; 13 -8.89,-1.27; 14 -8.89,1.27; 15 -6.35,-1.27; 16 -6.35,1.27; 17 -3.81,-1.27; 18 -3.81,1.27; 19 -1.27,-1.27; 20 -1.27,1.27; 21 1.27,-1.27; 22 1.27,1.27; 23 3.81,-1.27; 24 3.81,1.27; 25 6.35,-1.27; 26 6.35,1.27; 27 8.89,-1.27; 28 8.89,1.27; 29 11.43,-1.27; 30 11.43,1.27; 31 13.97,-1.27; 32 13.97,1.27; 33 16.51,-1.27; 34 16.51,1.27; 35 19.05,-1.27; 36 19.05,1.27; 37 21.59,-1.27; 38 21.59,1.27; 39 24.13,-1.27; 40 24.13,1.27
SOT223 = smd 1.219 x 2.235: 1 -2.311,-3.099; 2 0,-3.099; 3 2.311,-3.099 | smd 3.6 x 2.2: 4 0,3.099
TO220V = drill 1.016 long: 1 -2.54,-2.54; 2 0,-2.54; 3 2.54,-2.54
DO41Z10 = drill 1.118: A 5.08,0; C -5.08,0
CAP-PTH-LARGE = drill 0.9 pad 1.905: 1 -4.826,0; 2 4.572,0
SOD-323 = smd 0.63 x 0.83: A 1.15,0; C -1.15,0
G2R2 = drill 1.321 long: 1 -2.54,-3.683; 2 -2.54,3.81; O1 12.471,3.81; O2 12.471,-3.683; P1 17.45,3.81; P2 17.45,-3.683; S1 22.454,3.81; S2 22.454,-3.683
DIL04 = drill 0.813 offset: 1 -1.27,-3.81; 2 1.27,-3.81; 3 1.27,3.81; 4 -1.27,3.81
AXIAL-0.3-KIT = drill 1.016 pad 2.032: P$1 -3.81,0; P$2 3.81,0
SO08 = smd 0.61 x 2.21: 1 -1.905,-2.616; 2 -0.635,-2.616; 3 0.635,-2.616; 4 1.905,-2.616; 5 1.905,2.616; 6 0.635,2.616; 7 -0.635,2.616; 8 -1.905,2.616
S202S02 = drill 1: 1 -7.62,0; 2 -2.54,0; 3 5.08,0; 4 7.62,0
EI54-2 = drill 1.194 pad 3.81 octagon: 1 -15.011,15.011; 7 -15.011,-15.011; 8 15.011,-15.011; 9 15.011,-10.008; 13 15.011,10.008; 14 15.011,15.011
SOP65P640X120-14N = smd 1.473 x 0.356: 1 -2.819,1.956; 2 -2.819,1.295; 3 -2.819,0.66; 4 -2.819,0; 5 -2.819,-0.66; 6 -2.819,-1.295; 7 -2.819,-1.956; 8 2.819,-1.956; 9 2.819,-1.295; 10 2.819,-0.66; 11 2.819,0; 12 2.819,0.66; 13 2.819,1.295; 14 2.819,1.956
SOIC127P600X175-8N = smd 1.981 x 0.559: 1 -2.362,1.905; 2 -2.362,0.635; 3 -2.362,-0.635; 4 -2.362,-1.905; 5 2.362,-1.905; 6 2.362,-0.635; 7 2.362,0.635; 8 2.362,1.905
TERMINAL_BLOCK_4:METZ_AST1350404 = drill 1.4 pad 2.54 octagon: P$1 -7.5,0; P$2 -2.5,0; P$3 2.5,0; P$4 7.5,0
TERMINAL_BLOCK_6:METZ_AST1350604 = drill 1 pad 2.54 octagon: P$1 12.5,0; P$2 7.5,0; P$3 2.5,0; P$4 -2.5,0; P$5 -7.5,0; P$6 -12.5,0
TERMINAL_BLOCK_10:METZ_AST0451004 = drill 1.4 pad 2.54 octagon: P$1@1 -22.5,0; P$1@2 -22.5,5.2; P$2@1 -17.5,0; P$2@2 -17.5,5.2; P$3@1 -12.5,0; P$3@2 -12.5,5.2; P$4@1 -7.5,0; P$4@2 -7.5,5.2; P$5@1 -2.5,0; P$5@2 -2.5,5.2; P$6@1 2.5,0; P$6@2 2.5,5.2; P$7@1 7.5,0; P$7@2 7.5,5.2; P$8@1 12.5,0; P$8@2 12.5,5.2; P$9@1 17.5,0; P$9@2 17.5,5.2; P$10@1 22.5,0; P$10@2 22.5,5.2
SOIC-4 = smd 1.2 x 1.2: + 1.3,3.05; - -1.3,3.05; ~1 -1.3,-3.05; ~2 1.3,-3.05

### Placement (x,y rotation side)
5->3_1:R3  1.7  [1206]  58.67,50.8 90 top
5->3_1:R4  3.3  [1206]  51.31,50.8 270 top
5->3_1:U$1  OPA344  [SOT23-5]  59.79,56.65 180 top
5->3_2:R3  1.7  [1206]  20.07,52.07 180 top
5->3_2:R4  3.3  [1206]  20.07,48.26 0 top
5->3_2:U$1  OPA344  [SOT23-5]  21.74,56.78 180 top
7805  139.19,55.88 90 top
B2  131.57,73.66 180 top
B7  134.11,55.88 180 top
C1  169.67,57.15 270 top
C2  149.03,51.12 270 top
C3  149.35,59.69 270 top
C4  175.07,57.04 270 top
C5  165.86,71.12 90 top
C6  172.21,71.12 90 top
C7  154.43,54.61 90 top
C8  95.82,14.99 90 top
C9  154.5,59.8 270 top
C10  145.29,78.74 270 top
C11  116.33,20.57 0 top
C12  139.95,74.96 270 top
C13  145.29,69.85 270 top
C14  140.02,69.82 90 top
GPIO_CON1  118.87,4.45 180 top
IC1  160.78,55.88 90 top
IC2  154.43,73.66 270 top
REL_MOT:1N5355  ZPY  [DO41Z10]  35.05,76.2 180 top
REL_MOT:200  2k  [1206]  35.05,85.09 270 top
REL_MOT:C1  0.1uF  [CAP-PTH-LARGE]  12.19,40.64 180 bottom
REL_MOT:C15  1n  [1206]  14.99,57.91 270 top
REL_MOT:C16  0.1n  [1206]  14.22,66.8 0 top
REL_MOT:C17  10uF  [1206]  22.1,62.74 90 top
REL_MOT:D2  250mA/100V  [SOD-323]  17.78,61.21 180 top
REL_MOT:K1  G2R2  [G2R2]  33.78,68.33 270 top
REL_MOT:OK3  PC817  [DIL04]  27.11,82.55 270 top
REL_MOT:R1  400  [1206]  18.54,78.74 90 top
REL_MOT:R2  120  [AXIAL-0.3-KIT]  33.91,40.64 180 top
REL_MOT:R20  0.1M  [1206]  25.65,62.74 90 top
REL_MOT:T1  BDX53_STANDING  [TO220S]  21.08,73.66 90 top
REL_MOT:U$1  ACS712  [SO08]  9.65,60.58 270 top
SSR_MOT:200  2k  [1206]  60.71,73.66 270 top
SSR_MOT:C1  0.1uF  [CAP-PTH-LARGE]  50.29,40.64 0 top
SSR_MOT:C15  1n  [1206]  55.63,53.98 270 top
SSR_MOT:C16  0.1n  [1206]  52.3,64.86 0 top
SSR_MOT:C17  10uF  [1206]  57.15,62.99 90 top
SSR_MOT:D2  250mA/100V  [SOD-323]  53.99,61.11 180 top
SSR_MOT:K1  S102S02  [S202S02]  65.53,53.34 90 top
SSR_MOT:OK3  PC817  [DIL04]  66.8,72.14 180 top
SSR_MOT:R1  400  [1206]  72.14,75.69 90 top
SSR_MOT:R2  120  [AXIAL-0.3-KIT]  61.72,40.64 180 top
SSR_MOT:R20  0.1M  [1206]  60.45,62.99 90 top
SSR_MOT:U$1  ACS712  [SO08]  47.75,60.45 270 top
TR2  98.55,60.96 0 top
U1  115.32,16.26 0 top
U$1  104.14,15.75 180 top
U$2  160.78,73.66 270 top
U$3  62.99,5.08 0 top
U$6  164.59,5.08 0 top
U$8  24.89,10.28 180 top
WL1:B3  MB6S  [SOIC-4]  192.53,16.51 0 top
WL1:C4  10uF  [1206]  192.53,24.13 180 top
WL1:OK3  PC817  [DIL04]  192.66,34.16 0 top
WL1:R7  20k  [1206]  192.53,21.59 0 top
WL1:R8  2k  [1206]  192.53,26.8 0 top
WL1:R9  2k  [1206]  191.39,44.32 270 top
WL2:B3  MB6S  [SOIC-4]  183.64,16.51 0 top
WL2:C4  10uF  [1206]  183.64,24.13 180 top
WL2:OK3  PC817  [DIL04]  183.77,34.16 0 top
WL2:R7  20k  [1206]  183.64,21.59 0 top
WL2:R8  2k  [1206]  183.64,26.8 0 top
WL2:R9  2k  [1206]  182.5,44.32 270 top
WL4:B3  MB6S  [SOIC-4]  159.19,16.51 0 top
WL4:C4  10uF  [1206]  159.19,24.13 180 top
WL4:OK3  PC817  [DIL04]  159.32,34.16 0 top
WL4:R7  20k  [1206]  159.19,21.59 0 top
WL4:R8  2k  [1206]  159.19,26.8 0 top
WL4:R9  2k  [1206]  158.05,44.32 270 top
WL5:B3  MB6S  [SOIC-4]  150.3,16.51 0 top
WL5:C4  10uF  [1206]  150.3,24.13 180 top
WL5:OK3  PC817  [DIL04]  150.43,34.16 0 top
WL5:R7  20k  [1206]  150.3,21.59 0 top
WL5:R8  2k  [1206]  150.3,26.8 0 top
WL5:R9  2k  [1206]  149.16,44.32 270 top

### Tracks (layer width: path | path; a pad name or v marks a point on that pad's centre or on a via)
1_WATER_IN
  Top 1.422: U$6.P$1 184.91,5.08 191.23,11.4 WL1:B3.~1
2_WATER_IN
  Top 1.422: WL2:B3.~1 179.04,10.16 174.75,10.16 172.09,7.5 U$6.P$2
4_WATER_IN
  Top 1.422: U$6.P$4 162.09,7.9 157.92,12.06 157.92,13.43 WL4:B3.~1
5->3_1:N$1  (1 unrouted)
  Top 0.406: 5->3_1:U$1.1 60.71,57.92 60.71,56.77 60.45,56.52 59.18,56.52 58.84,56.17 5->3_1:U$1.4
  Top 0.813: 58.67,55.19 5->3_1:R3.2
5->3_2:N$1
  Top 0.406: 5->3_2:U$1.1 22.67,58.06 22.67,57.15 22.35,56.83 21.4,56.83 20.79,56.23 5->3_2:U$1.4
  Top 0.61: 5->3_2:U$1.4 18.67,53.35 5->3_2:R3.2
5_WATER_IN
  Top 1.422: WL5:B3.~1 149.03,13.43 149.03,11.43 150.94,9.53 154.11,9.53 157.09,6.55 U$6.P$5
230V0
  Bottom 1.422: REL_MOT:K1.P1 37.77,50.8
  Bottom 1.93: 37.77,50.8 SSR_MOT:K1.2 78.69,50.8 TR2.7 | U$8.P$3@1 U$8.P$3@2 | U$8.P$3@1 37.52,10.29 arc45 37.59,10.46 | U$8.P$3@1 37.39,14.94 arc-45 37.47,15.11 40.13,17.78 45.21,17.78 55.3,27.87 arc-45 55.48,27.94 65.53,27.94 TR2.7 | 83.31,45.72 TR2.7
230VPHASE  (via drill 0.6)
  Top 0.305: REL_MOT:U$1.2 REL_MOT:U$1.1 | SSR_MOT:U$1.2 SSR_MOT:U$1.1
  Top 1.93: SSR_MOT:U$1.1 45.21,62.43 45.21,91.44 47.75,93.98 | 47.75,93.98 73.15,93.98 83.54,83.59 TR2.1 93.47,66.04 93.47,45.72 v85.85,38.1 | 47.75,93.98 14.73,93.98 7.04,86.28 REL_MOT:U$1.1
  Bottom 1.93: U$8.P$1@2 U$8.P$1@1 47.75,10.16 60.45,22.86 70.61,22.86 v85.85,38.1
!SPI1_CS
  Top 0.406: GPIO_CON1.23 115.32,9.14 115.32,13.72 115.9,14.3 U1.8
!SPI2_CS
  Top 0.406: U$1.7 103.44,15.11 103.95,14.61 103.95,13.65 105.54,12.06 106.81,12.06 107.44,11.43 GPIO_CON1.29
AC12V  (via drill 0.6)  (1 unrouted)
  Top 1.422: TR2.13 TR2.9 113.58,50.97 | 113.41,50.8 106.17,50.8 104.27,48.9 | 104.27,48.9 98.55,43.18 v98.55,35.56 | U$6.P$3 167.09,4.41 163.96,1.27 155.9,1.27 U$6.P$6 151.89,5.08 144.27,12.7 v140.46,12.7 | v125.22,17.78 125.22,29.84 v121.41,33.66 | v113.79,41.27 111.89,41.27 104.27,48.9
  Bottom 1.422: 113.41,50.8 TR2.9 113.56,58.19 118.87,63.5 134.11,63.5 136.65,60.96 B7.AC1 | v140.46,12.7 130.3,12.7 v125.22,17.78 | v121.41,33.66 v113.79,41.27
  Bottom 1.93: U$3.P$2 60.45,5.12 60.45,12.7 65.53,17.78 73.15,17.78 78.23,22.86 88.39,22.86 98.55,33.02 v98.55,35.56
AC24V
  Top 1.422: TR2.14 118.64,75.97 118.87,76.2 121.41,73.66 132.84,73.66 134.11,74.93 B2.AC1
COMMON_EARTH
  Top 1.93: U$8.P$10@1 U$8.P$10@2 2.35,4.92 2.35,3.49 4.57,1.27 12.19,1.27 | U$8.P$8@1 U$8.P$8@2 12.39,1.47 12.19,1.27 | U$8.P$5@1 U$8.P$5@2 27.39,1.31 27.43,1.27 | 27.43,1.27 40.13,1.27 42.39,3.53 U$8.P$2@2 U$8.P$2@1 | 27.43,1.27 12.19,1.27
DC3.3V  (via drill 0.6)
  Top 0.406: C11.1 115.06,20.44 115.06,19.05 v115.38,18.73 115.9,18.21 U1.14 U1.13 | C8.1 98.8,13.59 v99.19,13.97 99.31,13.84 U$1.8
  Top 1.422: 150.3,45.72 | WL4:R9.1 | 150.3,45.72 WL5:R9.1 148.08,45.72 140.46,38.1 122.05,38.1 115.06,31.11 115.06,20.7 C11.1 | 150.3,45.72 WL4:R9.1 | WL1:R9.1 WL2:R9.1 170.94,45.72 167.13,49.53 | C4.1 174.58,58.93 C1.+ 167.13,58.93 | IC1.3 164.62,58.93 167.13,58.93 | 167.13,49.53 167.13,58.93 | WL4:R9.1 163.32,45.72 167.13,49.53
  Bottom 0.406: v99.19,13.97 110.62,13.97 v115.38,18.73
DC5V  (via drill 0.6)
  Top 0.61: 12.82,63.04 REL_MOT:U$1.8 | 50.9,62.89 SSR_MOT:U$1.8
  Top 0.813: 50.9,62.89 SSR_MOT:C16.1 50.8,64.96 50.8,67.56 58.3,75.06 SSR_MOT:200.1
  Top 1.422: REL_MOT:C16.1 12.82,63.04 | 12.82,65.41 REL_MOT:C16.1 | SSR_MOT:200.1 57.03,78.74 55.37,78.74 52.83,81.28 52.83,85.72 arc-90 53.47,86.36 v55.37,86.36 | REL_MOT:C16.1 12.82,69.21 14.73,71.12 14.73,83.82 17.27,86.36 v27.43,86.36 27.56,86.49 REL_MOT:200.1 | v93.47,88.9 163.32,88.9 176.02,76.2 176.02,68.58 170.94,63.5 156.97,63.5 154.68,61.2 C9.1 149.62,61.2 C3.+ 144.78,61.47 7805.3
  Bottom 1.422: v93.47,88.9 57.91,88.9 v55.37,86.36 v27.43,86.36
DC8V  (via drill 0.6)
  Top 1.422: v103.63,35.56 106.17,38.1 116.33,38.1 123.95,45.72 123.95,60.96 129.03,66.04 153.16,66.04 U$2.3 160.02,69.34 C5.+ 166.24,69.72 C6.1
  Bottom 1.93: U$3.P$4 70.61,5.08 70.61,10.16 73.15,12.7 85.85,12.7 103.63,30.48 v103.63,35.56
DC15V  (via drill 0.6)  (1 unrouted)
  Top 0.813: 5->3_2:U$1.5 22.73,55.52 24.33,55.52 29.77,60.96 29.97,60.96 29.97,71.12 | v57.91,71.12 62.99,66.04 62.99,55.88 62.47,55.35 5->3_1:U$1.5
  Top 1.422: v149.35,83.82 v93.47,83.82 | v68.07,83.82 v55.37,83.82 | IC2.3 145.8,71.12 C13.+ 144.78,71.63 141.58,68.42 C14.1
  Bottom 0.813: v55.37,83.82 55.37,73.66 v57.91,71.12 45.21,71.12 40.13,66.04 34.92,66.04 REL_MOT:K1.1
  Bottom 1.422: REL_MOT:1N5355.C 45.21,71.12 | v68.07,83.82 v93.47,83.82 | v149.35,83.82 148.08,82.55 148.08,73.66 146.05,71.63 C13.+
GND  (via drill 0.5, 0.5 pad 0.61, 0.6)
  Top 0.406: U1.12 116.48,16.92 v114.3,14.73 113.87,14.3 U1.7 | U$1.4 106.49,17.67 v106.49,18.73 | C8.2 95.95,16.51 v98.87,16.51
  Top 0.61: 50.92,58.55 SSR_MOT:U$1.5 50.29,58.47 50.29,57.91 | 5->3_2:U$1.2 21.74,59.33 v21.84,59.44 | REL_MOT:U$1.5 12.82,58.67 | C11.2 118.62,20.57 v119.89,19.3 | 5->3_1:U$1.2 59.82,57.98 v59.82,59.41 | 5->3_2:R4.1 14.73,48.26 13.21,49.78 v13.21,54.61
  Top 0.813: SSR_MOT:C16.2 54.16,64.39 SSR_MOT:C17.2 | SSR_MOT:C17.2 SSR_MOT:R20.2 | SSR_MOT:C17.2 v57.15,66.29 | 51.44,52.2 5->3_1:R4.1 51.31,52.32 50.29,53.34 v50.29,57.47 50.29,57.91 | 12.82,58.67 12.83,58.67 12.83,56.83 13.65,56.01 14.61,56.01
  Top 1.422: WL4:R7.1 v154.11,21.59 | WL4:B3.- 157.79,19.56 WL4:R7.1 | WL4:R7.1 WL4:C4.2 | WL5:R7.1 v145.22,21.59 | WL5:B3.- 148.9,19.56 WL5:R7.1 | WL5:C4.2 WL5:R7.1 | WL2:R7.1 v178.56,21.59 | WL2:B3.- 182.24,19.56 WL2:R7.1 | WL2:C4.2 WL2:R7.1 | WL1:R7.1 v187.45,21.59 | WL1:B3.- 191.13,19.56 WL1:R7.1 | WL1:R7.1 WL1:C4.2 | REL_MOT:C17.2 REL_MOT:R20.2 | C3.- 149.41,58.42 149.43,58.4 C9.2 154.5,56.07 C7.2 154.56,55.88 IC1.4 IC1.2 | REL_MOT:C17.2 v22.1,65.8 | REL_MOT:C15.2 14.99,56.39 14.61,56.01 v13.21,54.61 | SSR_MOT:C15.2 51.68,52.58 arc90 5->3_1:R4.1 | 139.85,73.66 C12.2 139.95,71.29 C14.2 135.49,71.22 135.38,71.12 B2.- | C6.2 171.83,72.9 C5.- | C4.2 174.81,55.37 C1.- | REL_MOT:C16.2 18.29,64.14 REL_MOT:C17.2
  pour Bottom (isolate 0.61, rank 3): 0,97.03 197.61,97.03 197.1,0 -0.51,0
MOTOR_DIRECT_1  (via drill 0.6)
  Top 0.406: U1.1 112.5,22.84 112.52,22.86 112.52,24.77
  Top 0.61: SSR_MOT:D2.A 55.53,58.42 v56.64,58.42 | v70.61,63.5 71.88,62.23 71.88,31.43 79.18,24.13 85.54,24.13 87.44,26.04 103.95,26.04 104.9,26.99 110.3,26.99 112.52,24.77
  Top 0.813: SSR_MOT:U$1.7 SSR_MOT:D2.A
  Bottom 0.61: v56.64,58.42 61.72,63.5 v70.61,63.5
MOTOR_DIRECT_2  (via drill 0.6)
  Top 0.406: U1.3 110.85,16.92 109.66,18.1 109.66,21.59
  Top 0.61: REL_MOT:U$1.7 REL_MOT:D2.A 18.54,59.3 v18.54,58.42 | v22.35,45.72 22.35,29.53 32.51,19.37 86.49,19.37 88.71,21.59 104.9,21.59 105.85,22.54 108.71,22.54 109.66,21.59
  Bottom 0.61: v18.54,58.42 22.35,54.61 v22.35,45.72
MOTOR_IN
  Bottom 1.93: SSR_MOT:K1.1 SSR_MOT:R2.P$1 65.53,35.56 62.99,33.02 50.4,33.02 arc45 50.22,32.95 42.67,25.4 35.16,25.4 arc45 34.98,25.33 32.51,22.86 32.51,10.38 arc-45 32.44,10.21 U$8.P$4@1 U$8.P$4@2
MOTOR_IN_2  (1 unrouted)
  Bottom 1.93: U$8.P$7@1 U$8.P$7@2 | REL_MOT:K1.S1 37.64,45.82 arc-45 37.72,45.64 REL_MOT:R2.P$1 37.67,40.59 arc45 37.59,40.41 37.59,38.1 35.13,35.63 arc-45 34.95,35.56 19.81,35.56 17.27,33.02 17.27,10.16
MOTOR_OUT_1
  Top 0.813: SSR_MOT:U$1.3 SSR_MOT:U$1.4
  Top 1.422: SSR_MOT:U$1.4 45.47,58.22
  Top 1.93: 45.47,58.22 SSR_MOT:C1.1
  Bottom 1.93: U$8.P$6@2 U$8.P$6@1 arc-45 22.35,10.26 22.35,27.94 24.89,30.48 40.13,30.48 45.39,35.74 arc45 45.47,35.92 SSR_MOT:C1.1
MOTOR_OUT_2  (via drill 0.6)  (1 unrouted)
  Top 0.813: REL_MOT:U$1.3 REL_MOT:U$1.4
  Top 1.422: REL_MOT:U$1.4 7.37,58.34
  Top 1.93: 7.37,58.34 v7.37,55.8
  Bottom 1.93: v7.37,55.8 REL_MOT:C1.1 | U$8.P$9@2 U$8.P$9@1 7.39,40.58
MOTOR_SENSE_1
  Top 0.61: 5->3_1:U$1.3 58.42,58.38 58.42,61.59
  Top 0.813: SSR_MOT:R20.1 58.42,61.59 SSR_MOT:C17.1 56.64,61.09 SSR_MOT:D2.C
MOTOR_SENSE_2
  Top 0.406: 5->3_2:U$1.3 20.79,59.02 20.83,59.02
  Top 0.61: 20.83,59.02 19.81,60.04 19.81,61.21
  Top 0.813: REL_MOT:C17.1 21.97,61.21 19.81,61.21 REL_MOT:D2.C
  Top 1.422: REL_MOT:R20.1 REL_MOT:C17.1
P1.3
  Top 0.305: WL2:R9.2 181.61,42.92
  Top 0.406: GPIO_CON1.7 135.38,32.32 136.33,33.27 177.8,33.27 WL2:OK3.4
  Top 1.422: WL2:R9.2 WL2:OK3.4
P1.5
  Top 0.406: WL4:OK3.4 155.89,35.31 133.54,35.31 130.3,32.07 GPIO_CON1.11
  Top 1.422: WL4:OK3.4 WL4:R9.2
P1.6  (via drill 0.6)
  Top 0.406: v102.36,8.57 GPIO_CON1.33
  Top 0.61: SSR_MOT:R1.1 75.69,70.74 75.69,60.96 78.23,58.42 v85.85,58.42 | v121.41,27.94 v121.41,17.78
  Bottom 0.406: 121.41,13.65 119.19,11.43 103.63,11.43 102.36,10.16 v102.36,8.57
  Bottom 0.61: v121.41,17.78 121.41,13.65 | v85.85,58.42 101.09,43.18 106.17,43.18 v121.41,27.94
P2.4
  Top 0.406: WL5:OK3.4 147.51,36.32 132.02,36.32 127.76,32.07 GPIO_CON1.13
  Top 1.422: WL5:OK3.4 WL5:R9.2
P2.7  (via drill 0.6)
  Top 0.61: 17.27,76.07 v17.27,71.12 | v17.27,45.72 19.81,43.18 19.81,22.86 27.43,15.24 89.66,15.24 93.47,11.43 98.55,11.43 99.82,10.16 GPIO_CON1.35
  Top 1.422: REL_MOT:R1.1 17.35,76.14 arc45 17.27,75.97 v17.27,71.12
  Bottom 0.61: v17.27,71.12 17.27,68.58 16,67.31 16,46.99 v17.27,45.72
P4.3
  Top 0.406: WL1:OK3.4 185.67,32.26 137.79,32.26 136.65,31.11 136.65,20 137.92,18.73 GPIO_CON1.5
  Top 1.422: WL1:OK3.4 WL1:R9.2
P6.0
  Top 0.406: U1.4 110.24,16.26 108.71,17.78 108.71,19.37
  Top 0.61: 5->3_2:R4.2 21.08,47.88 21.08,25.08 28.38,17.78 88.39,17.78 90.3,19.68 105.54,19.68 106.17,20.32 107.76,20.32 108.71,19.37
  Top 0.813: 5->3_2:R3.1 5->3_2:R4.2
P6.1
  Top 0.406: U1.2 111.48,17.55 110.62,18.41 110.62,23.18
  Top 0.61: 5->3_1:R3.1 5->3_1:R4.2 51.56,49.15 51.56,29.84 60.13,21.27 85.85,21.27 88.07,23.5 104.27,23.5 105.54,24.77 109.03,24.77 110.62,23.18
REC12V
  Top 1.422: IC1.1 162.28,53.57 160.78,52.07 156.97,52.07 155.83,53.21 C7.1 149.35,53.21 C2.+ 142.18,52.9 7805.1
  Bottom 1.422: B7.+ 134.11,55.88 137.92,55.88 140.46,53.34 7805.1
REC24V
  Top 1.422: U$2.1 IC2.1 151.89,77.47 149.35,80.01 145.8,80.01 C10.+ 144.78,80.01 139.19,80.01 | 139.19,80.01 139.95,79.25 C12.1 | 139.19,80.01 131.57,80.01 129.03,77.47 B2.+
REL_MOT:N$1
  Bottom 1.93: REL_MOT:C1.2 REL_MOT:R2.P$2
REL_MOT:N$3
  Top 1.422: REL_MOT:OK3.4 34.92,83.82 REL_MOT:200.2
REL_MOT:N$4
  Bottom 1.422: REL_MOT:T1.1 25.53,71.12 27.04,72.63 arc45 27.11,72.81 27.11,79.69 28.63,81.21 arc-45 28.81,81.28 REL_MOT:OK3.3
REL_MOT:N$10
  Top 1.422: 29.97,73.66 35.05,73.66 37.59,71.12 REL_MOT:K1.2 | REL_MOT:1N5355.A 29.97,73.66 | REL_MOT:T1.2 29.97,73.66
REL_MOT:N$13
  Top 1.422: REL_MOT:R1.2 18.54,82.87 19.42,83.75 arc-45 19.6,83.82 REL_MOT:OK3.1
REL_MOT:N$26
  Top 0.61: REL_MOT:U$1.6 14.35,59.94 REL_MOT:C15.1
SPI1_CLK
  Top 0.406: U1.11 120.9,16.26 122.68,14.48 GPIO_CON1.17
SPI1_MISO
  Top 0.406: U1.10 120.04,15.6 120.9,14.73 120.9,9.65 120.14,8.89 GPIO_CON1.19
SPI1_MOSI
  Top 0.406: U1.9 119.15,14.96 119.89,14.22 119.89,11.18 117.6,8.89 GPIO_CON1.21
SPI2_CLK
  Top 0.406: U$1.2 108.33,15.11 112.52,10.92 GPIO_CON1.25
SPI2_MISO
  Top 0.406: U$1.1 109.98,10.36 GPIO_CON1.27
SSR_MOT:N$1
  Bottom 1.422: SSR_MOT:C1.2 SSR_MOT:R2.P$2
SSR_MOT:N$3
  Top 0.813: SSR_MOT:OK3.4 68.07,71.12 66.93,72.26 SSR_MOT:200.2
SSR_MOT:N$4
  Top 0.813: SSR_MOT:K1.3 66.8,58.42 68.07,59.69 68.07,63.25 65.53,65.79 SSR_MOT:OK3.3
SSR_MOT:N$13
  Top 1.422: SSR_MOT:OK3.1 69.22,77.09 SSR_MOT:R1.2
SSR_MOT:N$26
  Top 0.61: SSR_MOT:U$1.6 52.07,59.82 52.83,59.05 52.83,58.17 SSR_MOT:C15.1
TRANS_OUT  (via drill 0.6)
  Top 1.422: TR2.8 113.79,45.72 116.33,45.72 118.87,48.26 118.87,66.04 123.95,71.12 B2.AC2 | WL1:B3.~2 193.8,13.49 193.8,14.92 192.85,15.88 184.91,15.88 | 184.91,15.88 160.46,15.88 | 160.46,15.88 151.57,15.88 | 151.57,15.88 v140.14,15.88 | v134.11,40.64 v134.11,50.8 | WL2:B3.~2 184.91,13.49 184.91,15.88 | WL4:B3.~2 160.46,13.49 160.46,15.88 | WL5:B3.~2 151.57,13.49 151.57,15.88
  Bottom 1.422: v140.14,15.88 136.97,15.88 134.11,18.73 v134.11,40.64 | TR2.8 124.18,45.95 B7.AC2 v134.11,50.8
WL1:N$12
  Top 1.422: WL1:B3.+ 193.93,19.66 WL1:R7.2 WL1:C4.1 WL1:R8.2
WL1:N$13
  Top 1.422: WL1:OK3.1 191.13,30.1 WL1:R8.1
WL2:N$12
  Top 1.422: WL2:B3.+ 184.94,21.49 WL2:R7.2 WL2:C4.1 WL2:R8.2
WL2:N$13
  Top 1.422: WL2:OK3.1 182.24,30.1 WL2:R8.1
WL4:N$12
  Top 1.422: WL4:B3.+ 160.49,21.49 WL4:R7.2 WL4:C4.1 WL4:R8.2
WL4:N$13
  Top 1.422: WL4:OK3.1 157.79,30.1 WL4:R8.1
WL5:N$12
  Top 1.422: WL5:B3.+ 151.6,21.49 WL5:R7.2 WL5:C4.1 WL5:R8.2
WL5:N$13
  Top 1.422: WL5:OK3.1 148.9,30.1 WL5:R8.1
(copper drawn outside any net)
  shapes: Top area x2

### Text on the board
tPlace: High voltage | DANGER! HIGH VOLTAGE! | Water Cleaning Management System / (c) ujoimro, 2015-05-11 / https://github.com/ViktorVaczi90/viztisztito | Olinuxino hole | Olinuxino hole | PE | MOTOR2 OUT | PE | MOTOR2 IN | MOTOR1 OUT | PE | MOTOR1 IN | 230V0 | PE | 230VACT | AC12v | GND | DC8V | WATER LEVEL SENSORS | PE | MOTOR2 OUT | PE | MOTOR2 IN | MOTOR1 OUT | PE | MOTOR1 IN | 230V0 | PE | 230VACT | AC12v | GND | DC8V | WATER LEVEL SENSORS